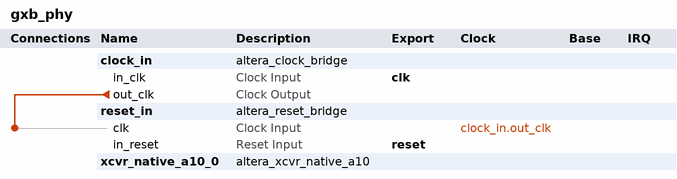
[diagram p0: system contents]
# Platform Designer (Qsys) system gxb_phy, Cyclone 10 GX 10CX220YF780E5G
# Parameters at their usual value, and those the tool derives, are not listed.
package require -exact qsys 1.0
create_system gxb_phy
set_project_property DEVICE_FAMILY {Cyclone 10 GX}
set_project_property DEVICE 10CX220YF780E5G

add_component clock_in ip/gxb_phy/gxb_phy_clock_in.ip altera_clock_bridge clock_in 18.1

add_component reset_in ip/gxb_phy/gxb_phy_reset_in.ip altera_reset_bridge reset_in 18.1

add_component xcvr_native_a10_0 ip/gxb_phy/gxb_phy_xcvr_native_a10_0.ip altera_xcvr_native_a10 xcvr_native_a10_0 18.1

# connections
add_connection clock_in.out_clk reset_in.clk clock

# exported interfaces
add_interface clk clock sink
set_interface_property clk EXPORT_OF clock_in.in_clk
add_interface reset reset sink
set_interface_property reset EXPORT_OF reset_in.in_reset

set_interconnect_requirement {$system} qsys_mm.clockCrossingAdapter HANDSHAKE
set_interconnect_requirement {$system} qsys_mm.enableEccProtection FALSE
set_interconnect_requirement {$system} qsys_mm.insertDefaultSlave FALSE
set_interconnect_requirement {$system} qsys_mm.maxAdditionalLatency 1

save_system gxb_phy.qsys
